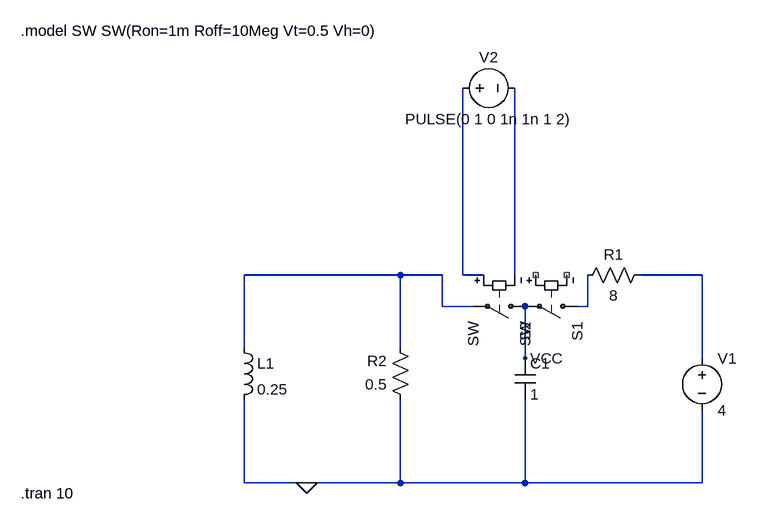
[diagram p0: schematic Q8_58.asc]
Q8_58.asc, the LTspice schematic file:
Version 4
SHEET 1 880 680
WIRE -128 -16 -368 -16
WIRE -64 -16 -128 -16
WIRE -32 -16 -32 -304
WIRE 0 -16 -32 -16
WIRE 48 -16 48 -304
WIRE 336 -16 240 -16
WIRE -64 32 -64 -16
WIRE -16 32 -64 32
WIRE 160 32 160 -16
WIRE 160 32 144 32
WIRE -368 96 -368 -16
WIRE -128 96 -128 -16
WIRE 64 112 64 32
WIRE 336 112 336 -16
WIRE -368 304 -368 176
WIRE -272 304 -368 304
WIRE -128 304 -128 176
WIRE -128 304 -272 304
WIRE 64 304 64 176
WIRE 64 304 -128 304
WIRE 336 304 336 192
WIRE 336 304 64 304
FLAG -272 304 0
FLAG 64 112 VCC
SYMBOL voltage 336 96 R0
WINDOW 123 0 0 Left 0
WINDOW 39 0 0 Left 0
SYMATTR InstName V1
SYMATTR Value 4
SYMBOL cap 48 112 R0
SYMATTR InstName C1
SYMATTR Value 1
SYMBOL res 256 -32 R90
WINDOW 0 0 56 VBottom 2
WINDOW 3 32 56 VTop 2
SYMATTR InstName R1
SYMATTR Value 8
SYMBOL res -112 192 R180
WINDOW 0 36 76 Left 2
WINDOW 3 36 40 Left 2
SYMATTR InstName R2
SYMATTR Value 0.5
SYMBOL ind -384 80 R0
SYMATTR InstName L1
SYMATTR Value 0.25
SYMBOL sw 160 32 R90
SYMATTR InstName S1
SYMBOL sw 80 32 R90
SYMATTR InstName S2
SYMBOL voltage -48 -304 R270
WINDOW 0 32 56 VTop 2
WINDOW 3 -32 56 VBottom 2
WINDOW 123 0 0 Left 0
WINDOW 39 0 0 Left 0
SYMATTR InstName V2
SYMATTR Value PULSE(0 1 0 1n 1n 1 2)
TEXT -712 -392 Left 2 !.model SW SW(Ron=1m Roff=10Meg Vt=0.5 Vh=0)
TEXT -712 320 Left 2 !.tran 10

The netlist it stands for:
* Q8_58.asc
V1 N004 0 4
C1 VCC 0 1
R1 N004 N005 8
R2 0 N001 0.5
L1 N001 0 0.25
S1 N005 VCC NC_01 NC_02 SW
S2 VCC N001 N002 N003 SW
V2 N002 N003 PULSE(0 1 0 1n 1n 1 2)
.model SW SW(Ron=1m Roff=10Meg Vt=0.5 Vh=0)
.tran 10
.backanno
.end